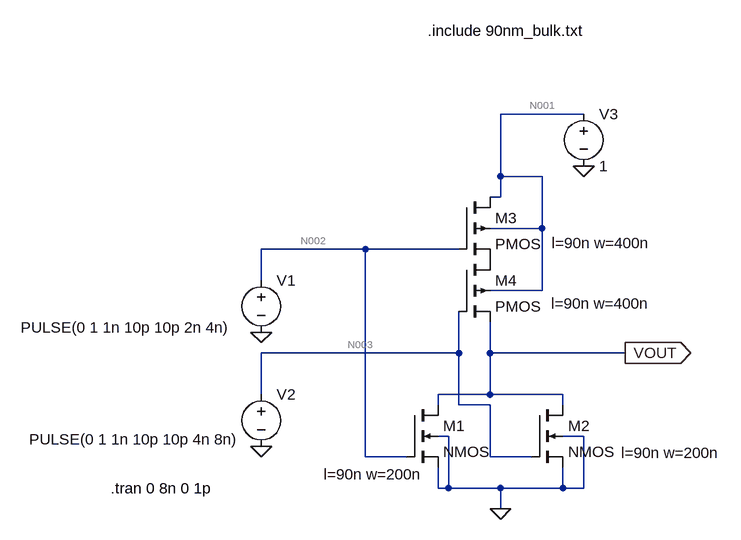
[diagram p0: schematic Draft1.asc]
Draft1.asc, the LTspice schematic file:
Version 4
SHEET 1 880 680
WIRE 416 -432 288 -432
WIRE 288 -336 288 -432
WIRE 352 -336 288 -336
WIRE 288 -304 288 -336
WIRE 288 -304 272 -304
WIRE 352 -256 352 -336
WIRE 352 -256 272 -256
WIRE 80 -224 -80 -224
WIRE 224 -224 80 -224
WIRE -80 -176 -80 -224
WIRE 352 -160 352 -256
WIRE 352 -160 272 -160
WIRE 224 -64 224 -128
WIRE 224 -64 -80 -64
WIRE 272 -64 272 -112
WIRE 480 -64 272 -64
WIRE -80 0 -80 -64
WIRE 272 0 272 -64
WIRE 272 0 192 0
WIRE 384 0 272 0
WIRE 192 16 192 0
WIRE 224 16 224 -64
WIRE 272 16 224 16
WIRE 384 16 384 0
WIRE 208 64 192 64
WIRE 416 64 384 64
WIRE 80 96 80 -224
WIRE 144 96 80 96
WIRE 272 96 272 16
WIRE 336 96 272 96
WIRE 192 144 192 112
WIRE 208 144 208 64
WIRE 208 144 192 144
WIRE 288 144 208 144
WIRE 384 144 384 112
WIRE 384 144 288 144
WIRE 416 144 416 64
WIRE 416 144 384 144
WIRE 288 176 288 144
FLAG -80 -96 0
FLAG -80 80 0
FLAG 288 176 0
FLAG 416 -352 0
FLAG 480 -64 VOUT
IOPIN 480 -64 Out
SYMBOL nmos4 144 16 R0
WINDOW 123 -128 107 Left 2
SYMATTR InstName M1
SYMATTR Value2 l=90n w=200n
SYMBOL nmos4 336 16 R0
WINDOW 123 138 74 Left 2
SYMATTR InstName M2
SYMATTR Value2 l=90n w=200n
SYMBOL pmos4 224 -304 R0
WINDOW 123 143 71 Left 2
SYMATTR InstName M3
SYMATTR Value2 l=90n w=400n
SYMBOL pmos4 224 -208 R0
WINDOW 123 142 68 Left 2
SYMATTR InstName M4
SYMATTR Value2 l=90n w=400n
SYMBOL voltage -80 -192 R0
WINDOW 3 -370 89 Left 2
WINDOW 123 0 0 Left 0
WINDOW 39 0 0 Left 0
SYMATTR InstName V1
SYMATTR Value PULSE(0 1 1n 10p 10p 2n 4n)
SYMBOL voltage -80 -16 R0
WINDOW 3 -357 85 Left 2
WINDOW 123 0 0 Left 0
WINDOW 39 0 0 Left 0
SYMATTR InstName V2
SYMATTR Value PULSE(0 1 1n 10p 10p 4n 8n)
SYMBOL voltage 416 -448 R0
WINDOW 123 0 0 Left 0
WINDOW 39 0 0 Left 0
SYMATTR InstName V3
SYMATTR Value 1
TEXT -312 144 Left 2 !.tran 0 8n 0 1p
TEXT 176 -560 Left 2 !.include 90nm_bulk.txt

The netlist it stands for:
* Draft1.asc
M1 VOUT N002 0 0 NMOS l=90n w=200n
M2 VOUT N003 0 0 NMOS l=90n w=200n
M3 N001 N002 P001 N001 PMOS l=90n w=400n
M4 P001 N003 VOUT N001 PMOS l=90n w=400n
V1 N002 0 PULSE(0 1 1n 10p 10p 2n 4n)
V2 N003 0 PULSE(0 1 1n 10p 10p 4n 8n)
V3 N001 0 1
.model NMOS NMOS
.model PMOS PMOS
.lib standard.mos
.tran 0 8n 0 1p
.include 90nm_bulk.txt
.backanno
.end

* Results of the author's LTspice run, read from the files saved beside the schematic
* Operating Point, zero values left out:
*   V(vout) = 999.9 mV
*   V(n001) = 1 V
*   V(p001) = 1 V
*   Id(M4) = 10.48 nA
*   Ig(M4) = -2.922 pA
*   Is(M4) = -10.47 nA
*   Id(M3) = 10.48 nA
*   Ig(M3) = -2.923 pA
*   Is(M3) = -10.48 nA
*   Id(M2) = 5.237 nA
*   Ig(M2) = -127.9 pA
*   Ib(M2) = -1.01 pA
*   Is(M2) = -5.108 nA
*   Id(M1) = 5.237 nA
*   Ig(M1) = -127.9 pA
*   Ib(M1) = -1.01 pA
*   Is(M1) = -5.108 nA
*   I(V3) = -10.48 nA
*   I(V2) = 130.9 pA
*   I(V1) = 130.9 pA
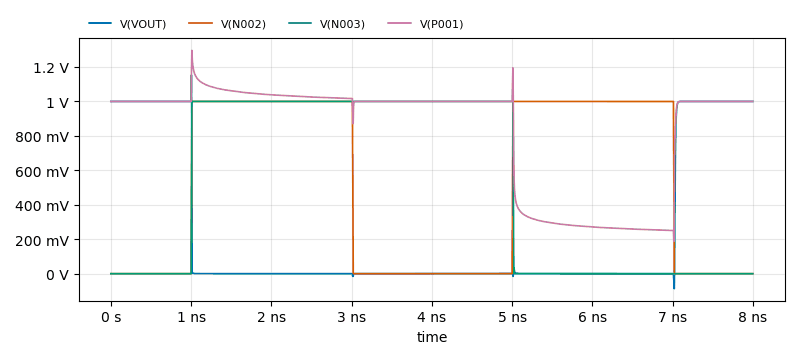
[diagram p1: Transient Analysis of Draft1.asc, plotted from the saved traces]
* Transient Analysis, 1 run:
*   V(VOUT): min -87.89 mV, max 1.154 V, average 247.1 mV, rms 496.6 mV, last 999.9 mV
*   V(N002): min 0 V, max 1 V, average 502.5 mV, rms 708.3 mV, last 0 V
*   V(N003): min 0 V, max 1 V, average 501.2 mV, rms 707.7 mV, last 0 V
*   V(P001): min 187.6 mV, max 1.296 V, average 832.5 mV, rms 891.7 mV, last 1 V